# Altium schematic sheet FULL_CB_CVSensor.SchDoc
size A4
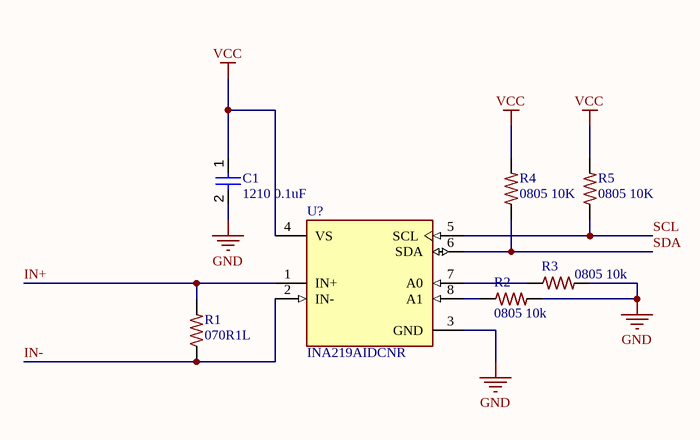
[diagram p0: FULL_CB_CVSensor.SchDoc]

## Parts
C1  1210 0.1uF
R1  070R1L
R2  0805 10k
R3  0805 10k
R4  0805 10K
R5  0805 10K
U?  INA219AIDCNR  [FP-DCN0008A-IPC_B]

## Nets
GND: C1.2 R2.P$2 R3.P$2 U?.3(GND)
VCC: C1.1 R4.P$2 R5.P$2 U?.4(VS)
IN+: R1.P$2 U?.1(IN+)
IN-: R1.P$1 U?.2(IN-)
SCL: R5.P$1 U?.5(SCL)
SDA: R4.P$1 U?.6(SDA)
NetR2_P$1: R2.P$1 U?.8(A1)
NetR3_P$1: R3.P$1 U?.7(A0)

## Library data of the parts
C1 = Capacitor 1210
R1 = PT2512FK
R2-R5 = SMD Resistor 0805
U? = CMP-0704-00041-3: IC CURRENT MONITOR 1% SOT23-8; Common Mode Rejection Ratio: 100dB; Bandwidth: 3.4MHz; Operating Supply Current: 1mA; Nominal Supply Current: 700uA; Min Input Voltage: 0V; Output Current per Channel: 10mA; Number of Amplifiers: 1; Input Offset Voltage (Vos): 100uV; Max Input Voltage: 26V; Min Supply Voltage: 3V; Max Supply Current: 5mA; Max Supply Voltage: 5.5V; Output Type: Digital; Accuracy: 1%; Radiation Hardening: No; Min Operating Temperature: -40°C; Contact Plating: Gold; REACH SVHC: No SVHC; Packaging: Tape and Reel; Max Operating Temperature: 125°C; Lead Free: Lead Free; Weight: 0.001411oz; Supply Current: 700uA; Number of Pins: 8; Length: 3mm; Quiescent Current: 700uA; Features: I²C; Height: 1.3mm; Output Current: 10mA; Case/Package: SOT-23-8; RoHS Compliant: Yes; Width: 1.75mm; Package Quantity: 3000; Series: Zero-Drift